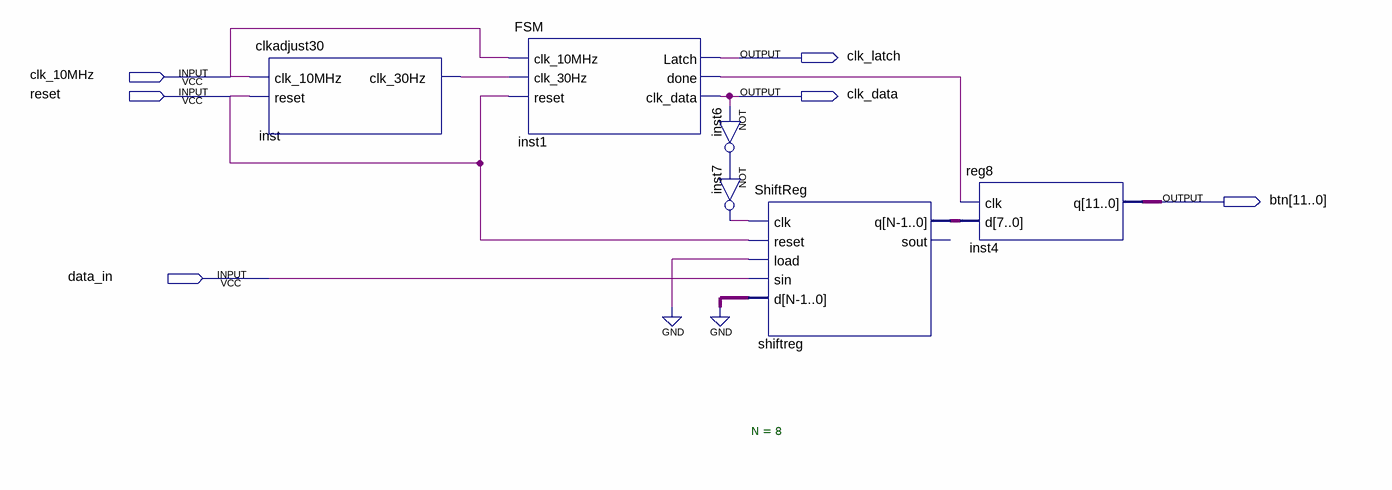
[diagram p0: schematic sheet]
// Quartus schematic nesdecoder.bdf as structural Verilog: 6 symbols, 6 pins
module nesdecoder (
  input  clk_10MHz,
  input  reset,
  input  data_in,
  output clk_latch,
  output clk_data,
  output [11:0] btn
);

  wire inst1_done, inst6_out, inst7_out, inst_clk_30hz;
  wire [7:0] shiftreg_q;

  clkadjust30 inst (.clk_10MHz(clk_10MHz), .reset(reset), .clk_30Hz(inst_clk_30hz));
  FSM inst1 (
    .clk_10MHz(clk_10MHz), .clk_30Hz(inst_clk_30hz), .reset(reset), .Latch(clk_latch), .done(inst1_done),
    .clk_data(clk_data));
  not inst6 (inst6_out, clk_data);
  not inst7 (inst7_out, inst6_out);
  ShiftReg #(.N(8)) shiftreg (
    .clk(inst7_out), .reset(reset), .load(1'b0), .sin(data_in), .d({8{1'b0}}), .q(shiftreg_q));  // open: sout
  reg8 inst4 (.clk(inst1_done), .d(shiftreg_q), .q(btn));
endmodule
